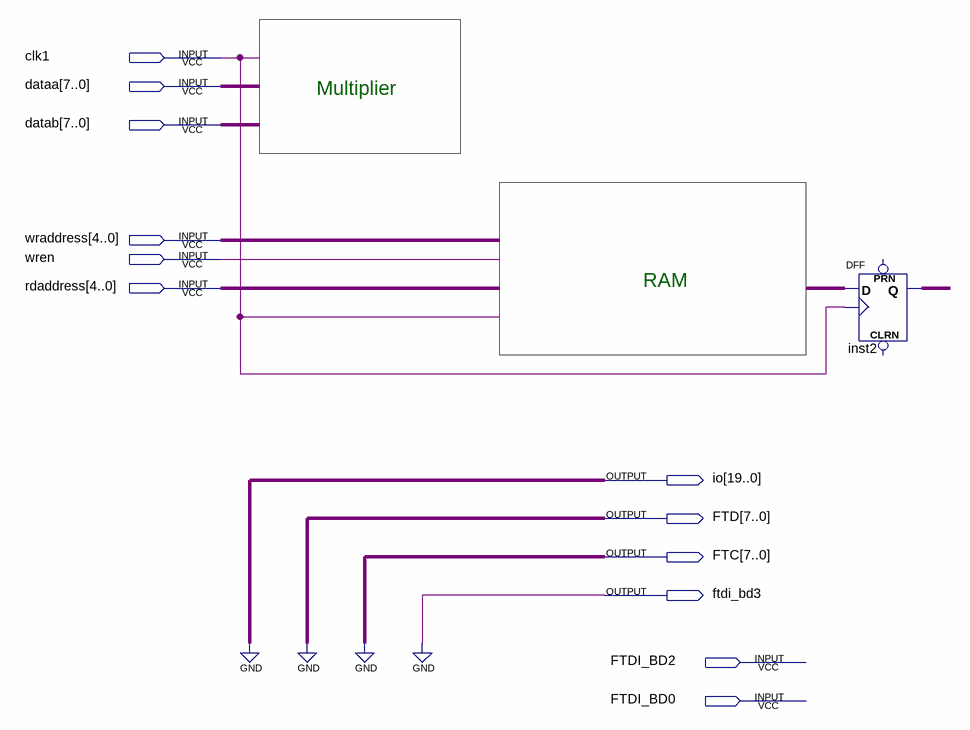
[diagram p0: schematic sheet]
// Quartus schematic pipemult.bdf as structural Verilog: 1 symbols, 12 pins
module pipemult (
  input  clk1,
  input  [7:0] dataa,
  input  [7:0] datab,
  input  [4:0] wraddress,
  input  wren,
  input  [4:0] rdaddress,
  input  FTDI_BD2,
  input  FTDI_BD0,
  output [19:0] io,
  output [7:0] FTD,
  output [7:0] FTC,
  output ftdi_bd3
);

  wire inst2_q, undriven;

  DFF inst2 (.CLK(clk1), .D(undriven), .Q(inst2_q));  // open: CLRN, PRN

  assign FTC = {8{1'b0}};
  assign FTD = {8{1'b0}};
  assign ftdi_bd3 = 1'b0;
  assign io = {20{1'b0}};

  // Notes on the sheet:
  //   Multiplier
  //   RAM
endmodule
